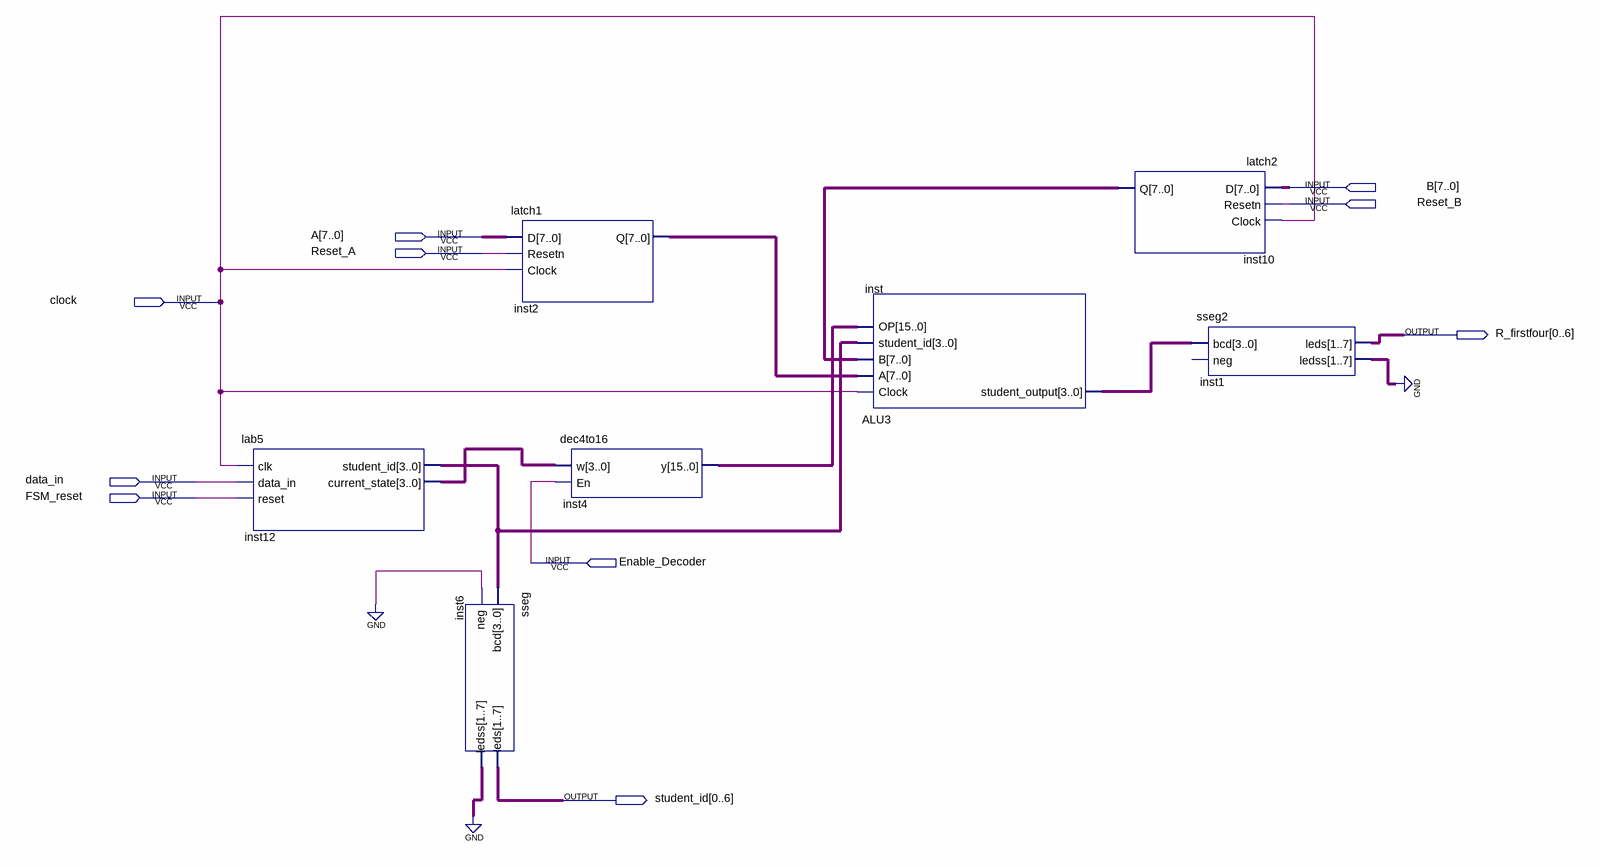
[diagram p0: schematic sheet]
// Quartus schematic p3.bdf as structural Verilog: 7 symbols, 10 pins
module p3 (
  input  [7:0] B,
  input  Reset_B,
  input  [7:0] A,
  input  Reset_A,
  input  clock,
  input  data_in,
  input  FSM_reset,
  input  Enable_Decoder,
  output [0:6] R_firstfour,
  output [0:6] student_id
);

  wire [3:0] inst12_current_state, inst12_student_id, inst_student_output;
  wire [6:0] inst1_ledss, inst6_ledss;
  wire [7:0] inst2_q, inst10_q;
  wire [15:0] inst4_y;

  lab5 inst12 (
    .clk(clock), .data_in(data_in), .reset(FSM_reset), .student_id(inst12_student_id),
    .current_state(inst12_current_state));
  sseg inst6 (.bcd(inst12_student_id), .neg(1'b0), .leds(student_id), .ledss(inst6_ledss));
  latch1 inst2 (.D(A), .Resetn(Reset_A), .Clock(clock), .Q(inst2_q));
  dec4to16 inst4 (.w(inst12_current_state), .En(Enable_Decoder), .y(inst4_y));
  ALU3 inst (
    .Clock(clock), .A(inst2_q), .B(inst10_q), .student_id(inst12_student_id), .OP(inst4_y),
    .student_output(inst_student_output));
  latch2 inst10 (.D(B), .Resetn(Reset_B), .Clock(clock), .Q(inst10_q));
  sseg2 inst1 (.bcd(inst_student_output), .leds(R_firstfour), .ledss(inst1_ledss));  // open: neg
  // also tied to GND on the sheet: {inst6_ledss[0], inst6_ledss[1], inst6_ledss[2], inst6_ledss[3], inst6_ledss[4], inst6_ledss[5], inst6_ledss[6], inst1_ledss[0], inst1_ledss[1], inst1_ledss[2], inst1_ledss[3], inst1_ledss[4], inst1_ledss[5], inst1_ledss[6]}
endmodule
